# EAGLE design untitled (EAGLE 6.6.0)
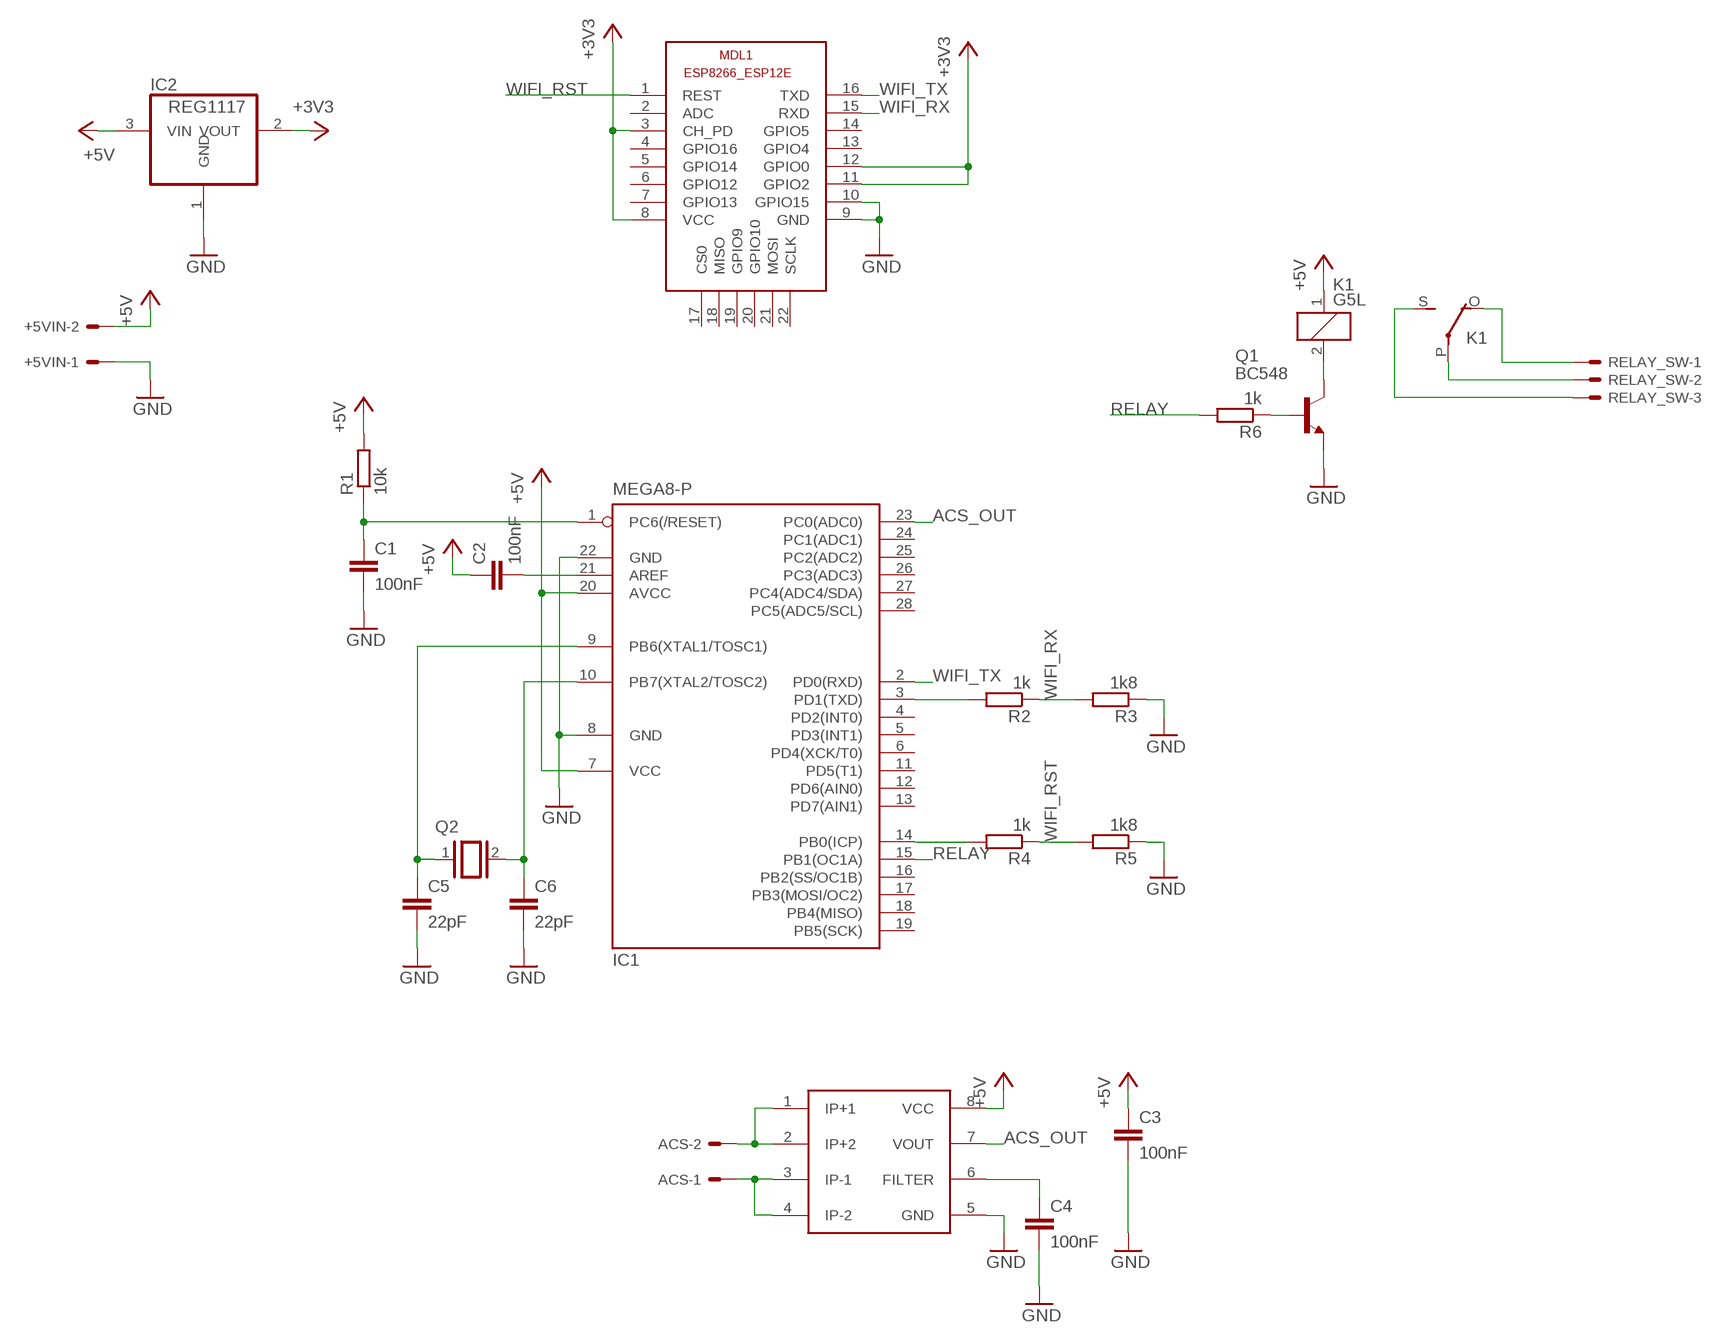
[diagram p0: schematic, sheet 1]

## Parts
+5VIN  KK-156-2  [KK-156-2]
ACS  KK-156-2  [KK-156-2]
C1  100nF  C-EU050-030X075  [C050-030X075]
C2  100nF  C-EU050-030X075  [C050-030X075]
C3  100nF  C-EU050-030X075  [C050-030X075]
C4  100nF  C-EU050-030X075  [C050-030X075]
C5  22pF  C-EU050-030X075  [C050-030X075]
C6  22pF  C-EU050-030X075  [C050-030X075]
IC1  MEGA8-P  [DIL28-3]
IC2  REG1117  [SOT223]
K1  G5L  [G5LE]
MDL1  ESP8266-12EESP8266-ESP12E  [ESP8266-ESP12E]
Q1  BC548  [TO92-EBC]
Q2  XTAL/S  [QS]
R1  10k  R-EU_0204/5  [0204/5]
R2  1k  R-EU_0204/5  [0204/5]
R3  1k8  R-EU_0204/5  [0204/5]
R4  1k  R-EU_0204/5  [0204/5]
R5  1k8  R-EU_0204/5  [0204/5]
R6  1k  R-EU_0204/5  [0204/5]
RELAY_SW  KK-156-3  [KK-156-3]
U$1  ACS712  [SO08]

## Nets
+3V3: IC2.2(VOUT) MDL1.3(CH_PD) MDL1.8(VCC) MDL1.11(GPIO2) MDL1.12(GPIO0)
+5V: +5VIN.2 C2.1 C3.1 IC1.7(VCC) IC1.20(AVCC) IC2.3(VIN) K1.1 R1.2 U$1.8(VCC)
ACS_OUT: IC1.23(PC0(ADC0)) U$1.7(VOUT)
GND: +5VIN.1 C1.2 C3.2 C4.2 C5.2 C6.2 IC1.8(GND) IC1.22(GND) IC2.1(GND) MDL1.9(GND) MDL1.10(GPIO15) Q1.E R3.1 R5.1 U$1.5(GND)
N$1: IC1.3(PD1(TXD)) R2.2
N$2: C2.2 IC1.21(AREF)
N$3: IC1.14(PB0(ICP)) R4.2
N$4: K1.2 Q1.C
N$5: Q1.B R6.1
N$6: K1.P(2:P) RELAY_SW.2
N$7: K1.O(2:O) RELAY_SW.1
N$8: K1.S(2:S) RELAY_SW.3
N$9: ACS.2 U$1.1(IP+1) U$1.2(IP+2)
N$10: ACS.1 U$1.3(IP-1) U$1.4(IP-2)
N$11: C5.1 IC1.9(PB6(XTAL1/TOSC1)) Q2.1
N$12: C6.1 IC1.10(PB7(XTAL2/TOSC2)) Q2.2
N$13: C1.1 IC1.1(PC6(/RESET)) R1.1
N$14: C4.1 U$1.6(FILTER)
RELAY: IC1.15(PB1(OC1A)) R6.2
WIFI_RST: MDL1.1(REST) R4.1 R5.2
WIFI_RX: MDL1.15(RXD) R2.1 R3.2
WIFI_TX: IC1.2(PD0(RXD)) MDL1.16(TXD)
Unconnected: IC1.4(PD2(INT0)) IC1.5(PD3(INT1)) IC1.6(PD4(XCK/T0)) IC1.11(PD5(T1)) IC1.12(PD6(AIN0)) IC1.13(PD7(AIN1)) IC1.16(PB2(SS/OC1B)) IC1.17(PB3(MOSI/OC2)) IC1.18(PB4(MISO)) IC1.19(PB5(SCK)) IC1.24(PC1(ADC1)) IC1.25(PC2(ADC2)) IC1.26(PC3(ADC3)) IC1.27(PC4(ADC4/SDA)) IC1.28(PC5(ADC5/SCL)) MDL1.2(ADC) MDL1.4(GPIO16) MDL1.5(GPIO14) MDL1.6(GPIO12) MDL1.7(GPIO13) MDL1.13(GPIO4) MDL1.14(GPIO5) MDL1.17(CS0) MDL1.18(MISO) MDL1.19(GPIO9) MDL1.20(GPIO10) MDL1.21(MOSI) MDL1.22(SCLK)

## Library data of the parts
+5VIN ACS = con-molex:KK-156-2: KK 156 HEADER Source: http://www.molex.com/pdm_docs/sd/026604100_sd.pdf; OC_FARNELL: unknown; OC_NEWARK: unknown
C1-C6 = rcl:C-EU: CAPACITOR, European symbol
IC1 = atmel:MEGA8-P: MICROCONTROLLER 8 Kbytes FLASH, 1 kbytes SRAM, 512 bytes EEPROM, USART, 4-channel 10 bit ADC, 2-channel 8 bit ADC Pin compatible with Atmega48, ATMega88, ATMega168 Source: avr.lbr; OC_FARNELL: unknown; OC_NEWARK: unknown
IC2 = burr-brown:REG1117: 800mA and 1A Low Dropout (LDO) Positive Regulator 1.8V, 2.5V, 2.85V, 3.3V, 5V, and Adj; MPN: REG1117; OC_FARNELL: 1097566; OC_NEWARK: 14P6981
K1 = relay:G5L: RELAY 1 x switch, 10 A/120 V AC, 8 A/30 V ADC, Omron; OC_FARNELL: unknown; OC_NEWARK: unknown
MDL1 = ESP8266-ESP12E:ESP8266-12E: ESP8266-12E with additional I/O and GPIO04/05 corrected The author cannot warrant that this library is free from error or will meet your specific requirements. Created by PuceBaboon.com. Komagane, Nagano, JAPAN
Q1 = transistor-npn:BC548*: NPN Transistor
Q2 = special:XTAL/S: CRYSTAL
R1-R6 = rcl:R-EU_: RESISTOR, European symbol
RELAY_SW = con-molex:KK-156-3: KK 156 HEADER Source: http://www.molex.com/pdm_docs/sd/026604100_sd.pdf; OC_FARNELL: unknown; OC_NEWARK: unknown
U$1 = untitled:ACS712

## Board
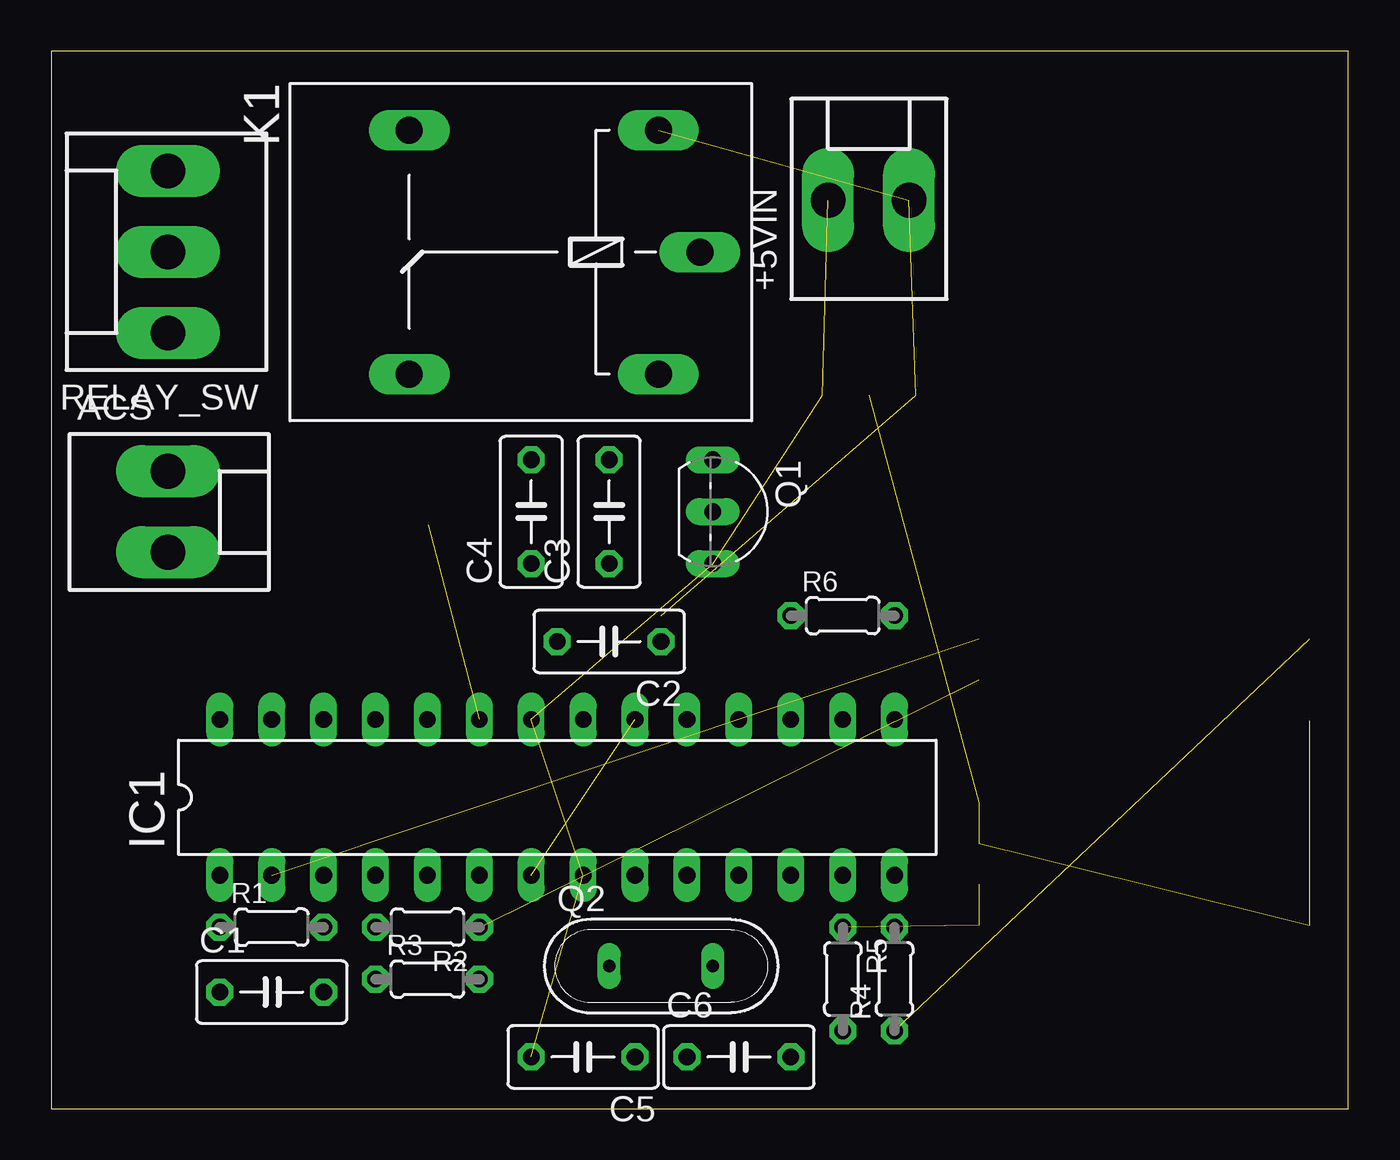
[diagram p1: board, top side]
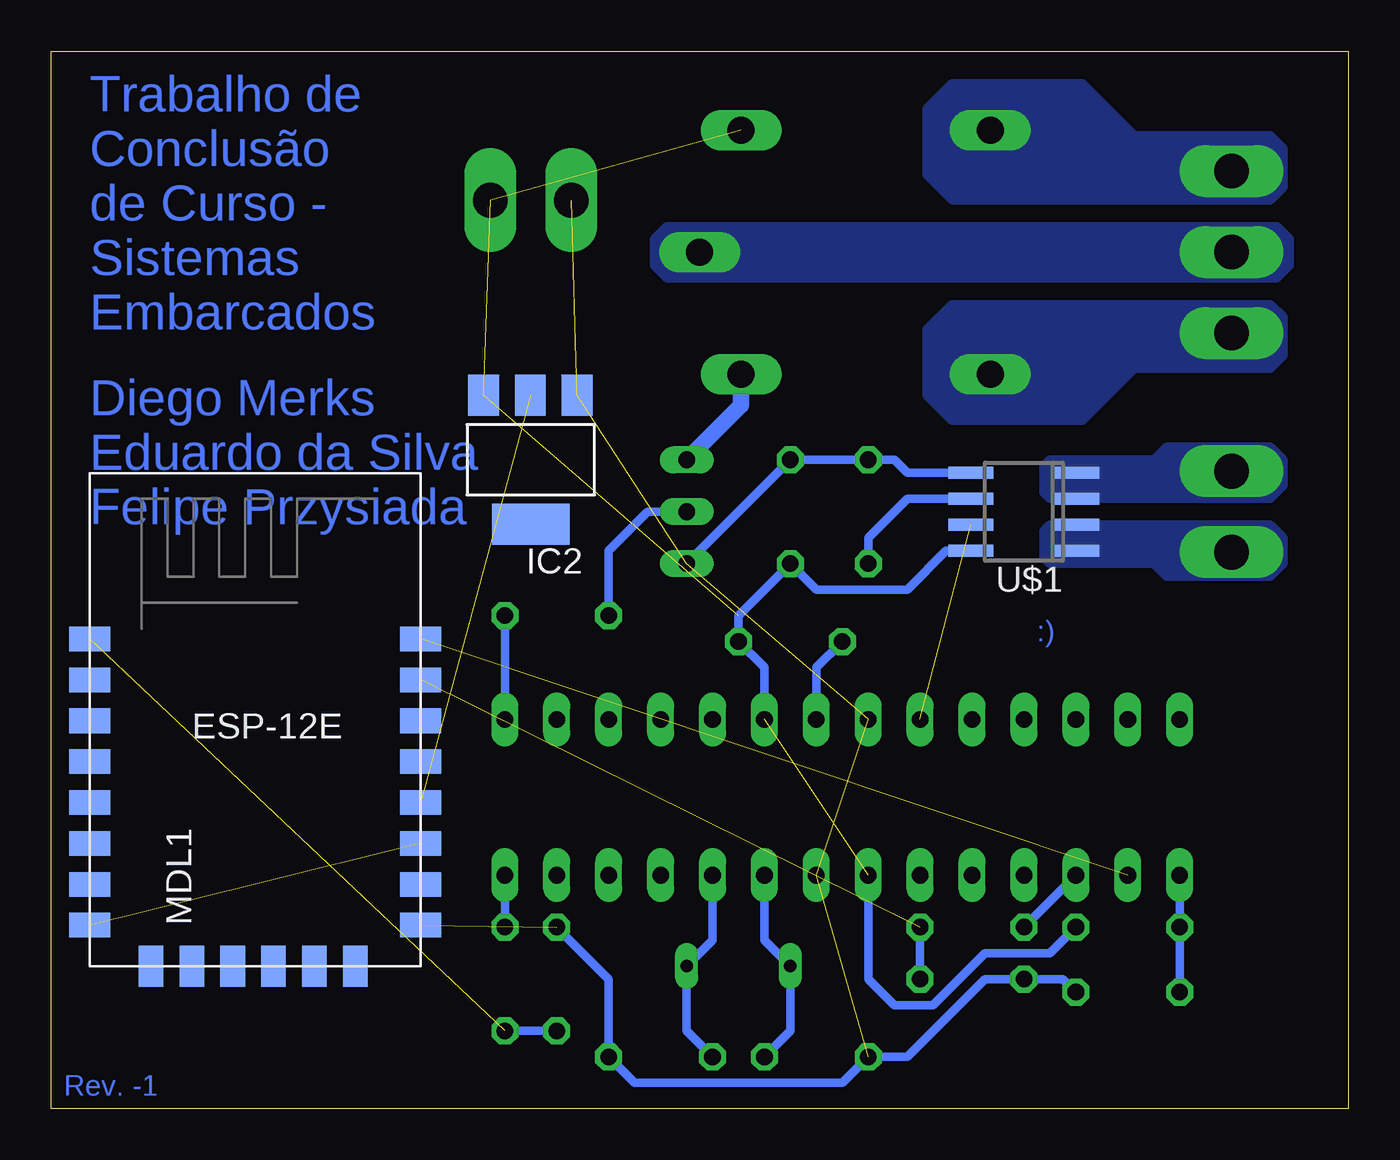
[diagram p2: board, bottom side, seen from below]

Size 63.48 x 51.74 mm. Coordinates in mm from the lower left corner, seen from the top.
Outline: 0,0 63.48,0 63.48,51.74 0,51.74 0,0
Copper layers (1*16): Top 0.035mm / dielectric 1.5mm / Bottom 0.035mm
Design rules "default": minimum track width 10mil, minimum drill 24mil, track to track 8mil, track to pad 8mil, pad to pad 8mil, via to via 8mil, smd to smd 8mil, copper to edge 40mil, drill to drill 8mil, minimum pad ring 10mil, minimum via ring 8mil, stop-mask expansion 4mil, vias tented up to drill 0mil, thermal gap 10mil

### Footprints (pad centres in the part's own frame; a part is rotated, then mirrored left to right if it is on the bottom)
KK-156-2 = drill 1.7 pad 2.184 long: 1 -1.98,0; 2 1.98,0
C050-030X075 = drill 0.813 octagon: 1 -2.54,0; 2 2.54,0
DIL28-3 = drill 0.813 long: 1 -16.51,-3.81; 2 -13.97,-3.81; 3 -11.43,-3.81; 4 -8.89,-3.81; 5 -6.35,-3.81; 6 -3.81,-3.81; 7 -1.27,-3.81; 8 1.27,-3.81; 9 3.81,-3.81; 10 6.35,-3.81; 11 8.89,-3.81; 12 11.43,-3.81; 13 13.97,-3.81; 14 16.51,-3.81; 15 16.51,3.81; 16 13.97,3.81; 17 11.43,3.81; 18 8.89,3.81; 19 6.35,3.81; 20 3.81,3.81; 21 1.27,3.81; 22 -1.27,3.81; 23 -3.81,3.81; 24 -6.35,3.81; 25 -8.89,3.81; 26 -11.43,3.81; 27 -13.97,3.81; 28 -16.51,3.81
SOT223 = smd 1.499 x 2.007: 1 -2.261,-3.15; 2 0.025,-3.15; 3 2.311,-3.15 | smd 3.81 x 2.007: 4 0,3.15
G5LE = drill 1.321 long: 1 -7.493,-5.969; 2 -7.493,5.969; O 4.699,5.969; P -9.525,0; S 4.699,-5.969
ESP8266-ESP12E = smd 2 x 1.2: 1 0,16; 2 0,14; 3 0,12; 4 0,10; 5 0,8; 6 0,6; 7 0,4; 8 0,2; 9 16.2,2; 10 16.2,4; 11 16.2,6; 12 16.2,8; 13 16.2,10; 14 16.2,12; 15 16.2,14; 16 16.2,16 | smd 1.2 x 2: 17 11,0; 18 3,0; 19 5,0; 20 13,0; 21 7,0; 22 9,0
TO92-EBC = drill 0.813 long: B 0,-1.27; C -2.54,-1.27; E 2.54,-1.27
QS = drill 0.61 long: 1 -2.54,0; 2 2.54,0
0204/5 = drill 0.813 octagon: 1 -2.54,0; 2 2.54,0
KK-156-3 = drill 1.7 pad 2.184 long: 1 -3.96,0; 2 0,0; 3 3.96,0
SO08 = smd 0.6 x 2.2: 1 -1.905,-2.6; 2 -0.635,-2.6; 3 0.635,-2.6; 4 1.905,-2.6; 5 1.905,2.6; 6 0.635,2.6; 7 -0.635,2.6; 8 -1.905,2.6

### Placement (x,y rotation side)
+5VIN  40.01,44.45 0 top
ACS  5.71,29.21 270 top
C1  10.79,5.71 0 top
C2  27.3,22.86 180 top
C3  27.3,29.21 90 top
C4  23.5,29.21 90 top
C5  26.04,2.54 180 top
C6  33.66,2.54 0 top
IC1  24.77,15.24 0 top
IC2  40.01,31.75 180 bottom
K1  22.23,41.91 180 top
MDL1  61.59,6.99 0 bottom
Q1  33.66,29.21 270 top
Q2  29.84,6.99 0 top
R1  10.79,8.89 0 top
R2  18.41,8.89 180 top
R3  18.41,6.35 0 top
R4  41.27,6.35 90 top
R5  38.73,6.35 270 top
R6  38.73,24.13 0 top
RELAY_SW  5.71,41.91 90 top
U$1  15.88,29.21 90 bottom

### Tracks (layer width: path | path; a pad name or v marks a point on that pad's centre or on a via)
+3V3  (4 unrouted)
+5V  (4 unrouted)
  Bottom 0.406: U$1.8 19.68,27.3 21.59,25.4 26.04,25.4 C3.1 29.84,24.13 C2.1 28.57,21.59 IC1.20 | IC1.7 23.5,6.35 22.23,5.08 20.32,5.08 17.78,7.62 14.61,7.62 R1.2
ACS_OUT  (1 unrouted)
GND  (7 unrouted)
  Bottom 0.406: U$1.5 21.59,31.11 22.23,31.75 C4.2 C3.2 Q1.E | C1.2 13.97,6.35 R3.1 17.78,6.35 21.59,2.54 C5.2 24.77,1.27 34.92,1.27 C6.2 36.2,6.35 R5.1
N$1
  Bottom 0.406: IC1.3 R2.2
N$2
  Bottom 0.406: C2.2 26.04,21.59 IC1.21
N$3
  Bottom 0.406: IC1.14 R4.2
N$4
  Bottom 0.813: K1.2 29.72,34.42 Q1.C
N$5
  Bottom 0.406: Q1.B 34.29,29.21 36.2,27.3 R6.1
N$6
  pour Bottom (no thermals): 3.49,40.64 33.34,40.64 33.97,41.27 33.97,42.55 33.34,43.18 3.49,43.18 2.86,42.55 2.86,41.27
N$7
  pour Bottom (no thermals): 3.81,36.2 10.48,36.2 13.02,33.66 19.37,33.66 20.64,34.92 20.64,38.1 19.37,39.37 3.81,39.37 3.17,38.73 3.17,36.83
N$8
  pour Bottom (no thermals): 3.81,47.62 10.48,47.62 13.02,50.16 19.37,50.16 20.64,48.9 20.64,45.72 19.37,44.45 3.81,44.45 3.17,45.09 3.17,46.99
N$9
  pour Bottom (no thermals): 3.81,28.57 14.61,28.57 14.92,28.26 14.92,26.99 14.61,26.67 9.53,26.67 8.89,26.04 3.81,26.04 3.17,26.67 3.17,27.94
N$10
  pour Bottom (no thermals): 3.81,29.84 14.61,29.84 14.92,30.16 14.92,31.43 14.61,31.75 9.53,31.75 8.89,32.38 3.81,32.38 3.17,31.75 3.17,30.48
N$11
  Bottom 0.406: IC1.9 28.57,8.26 Q2.1 27.3,3.81 C5.1
N$12
  Bottom 0.406: IC1.10 31.11,8.26 Q2.2 32.38,3.81 C6.1
N$13
  Bottom 0.406: C1.1 R1.1 IC1.1
N$14
  Bottom 0.406: U$1.6 21.59,29.84 23.5,27.94 C4.1
RELAY
  Bottom 0.406: IC1.15 R6.2
WIFI_RST  (1 unrouted)
  Bottom 0.406: R4.1 R5.2
WIFI_RX  (1 unrouted)
  Bottom 0.406: R2.1 R3.2
WIFI_TX  (1 unrouted)

### Text on the board
Bottom: Trabalho de / Conclusão / de Curso - / Sistemas / Embarcados | Diego Merks / Eduardo da Silva / Felipe Przysiada | :) | Rev. -1